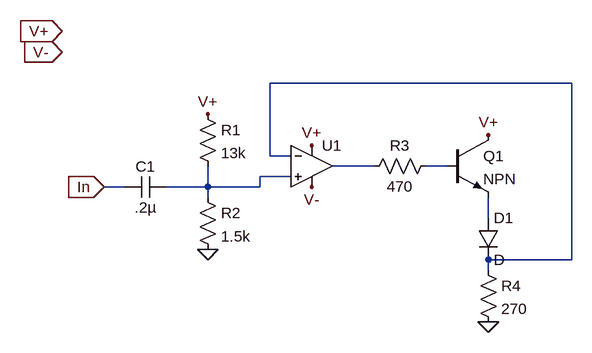
[diagram p0: schematic OpticalTransmitter.asc]
OpticalTransmitter.asc, the LTspice schematic file:
Version 4
SHEET 1 880 680
WIRE 368 -96 -96 -96
WIRE -96 16 -96 -96
WIRE -64 16 -96 16
WIRE 64 32 0 32
WIRE 176 32 144 32
WIRE -64 48 -112 48
WIRE -320 64 -352 64
WIRE -192 64 -192 32
WIRE -192 64 -256 64
WIRE -112 64 -112 48
WIRE -112 64 -192 64
WIRE -192 80 -192 64
WIRE 240 112 240 80
WIRE 240 176 240 160
WIRE 368 176 368 -96
WIRE 368 176 240 176
WIRE 240 192 240 176
FLAG -416 -176 V+
IOPIN -416 -176 In
FLAG -416 -144 V-
IOPIN -416 -144 In
FLAG -32 0 V+
FLAG -32 64 V-
FLAG -352 64 In
IOPIN -352 64 In
FLAG -192 160 0
FLAG 240 272 0
FLAG 240 -16 V+
FLAG -192 -48 V+
SYMBOL Opamps\\UniversalOpamp2 -32 32 R0
SYMATTR InstName U1
SYMBOL res -208 -64 R0
SYMATTR InstName R1
SYMATTR Value 13k
SYMBOL res -208 64 R0
SYMATTR InstName R2
SYMATTR Value 1.5k
SYMBOL cap -256 48 R90
WINDOW 0 0 32 VBottom 2
WINDOW 3 32 32 VTop 2
SYMATTR InstName C1
SYMATTR Value .2µ
SYMBOL res 160 16 R90
WINDOW 0 0 56 VBottom 2
WINDOW 3 32 56 VTop 2
SYMATTR InstName R3
SYMATTR Value 470
SYMBOL npn 176 -16 R0
SYMATTR InstName Q1
SYMBOL diode 224 112 R0
SYMATTR InstName D1
SYMBOL res 224 176 R0
SYMATTR InstName R4
SYMATTR Value 270

The netlist it stands for:
* OpticalTransmitter.asc
XU1 N004 N001 V+ V- N002 level.2 Avol=1Meg GBW=10Meg Slew=10Meg ilimit=25m rail=0 Vos=0 phimargin=45 en=0 enk=0 in=0 ink=0 Rin=500Meg  ; pins IN+ IN- V+ V- OUT
R1 V+ N004 13k
R2 N004 0 1.5k
C1 N004 In .2µ
R3 N003 N002 470
Q1 V+ N003 N005 0 NPN
D1 N005 N001 D
R4 N001 0 270
.model D D
.lib standard.dio
.model NPN NPN
.model PNP PNP
.lib standard.bjt
.lib UniversalOpamps2.sub
.backanno
.end